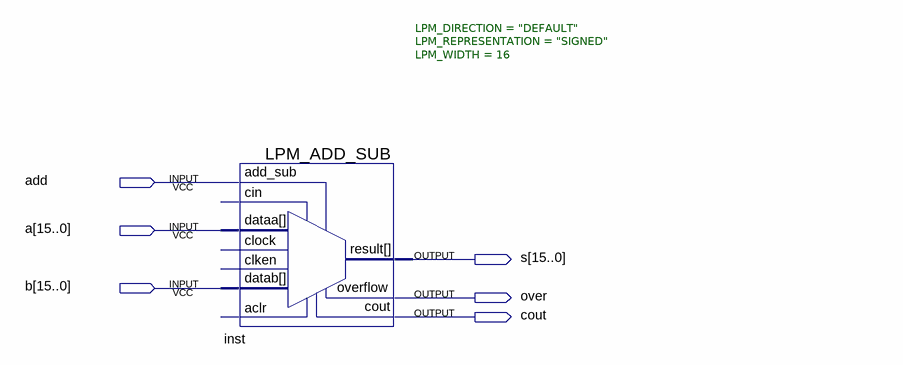
[diagram p0: schematic sheet]
// Quartus schematic adder16a.bdf as structural Verilog: 1 symbols, 6 pins
module adder16a (
  input  add,
  input  [15:0] a,
  input  [15:0] b,
  output [15:0] s,
  output over,
  output cout
);

  LPM_ADD_SUB #(.LPM_DIRECTION("DEFAULT"), .LPM_REPRESENTATION("SIGNED"), .LPM_WIDTH(16)) inst (
    .datab(b), .add_sub(add), .dataa(a), .cout(cout), .overflow(over), .result(s));  // open: cin, aclr, clock, clken
endmodule
